# Altium schematic sheet 1x_limit_switch.SchDoc
size B; Author: AM; CompanyName: Expatria Technologies; DrawnBy: A.Marles; Engineer: AM; Organization: Expatria Technologies; DocumentNumber: 6; Revision: A1; SheetNumber: 6; SheetTotal: 14; PCB_Rev: A1
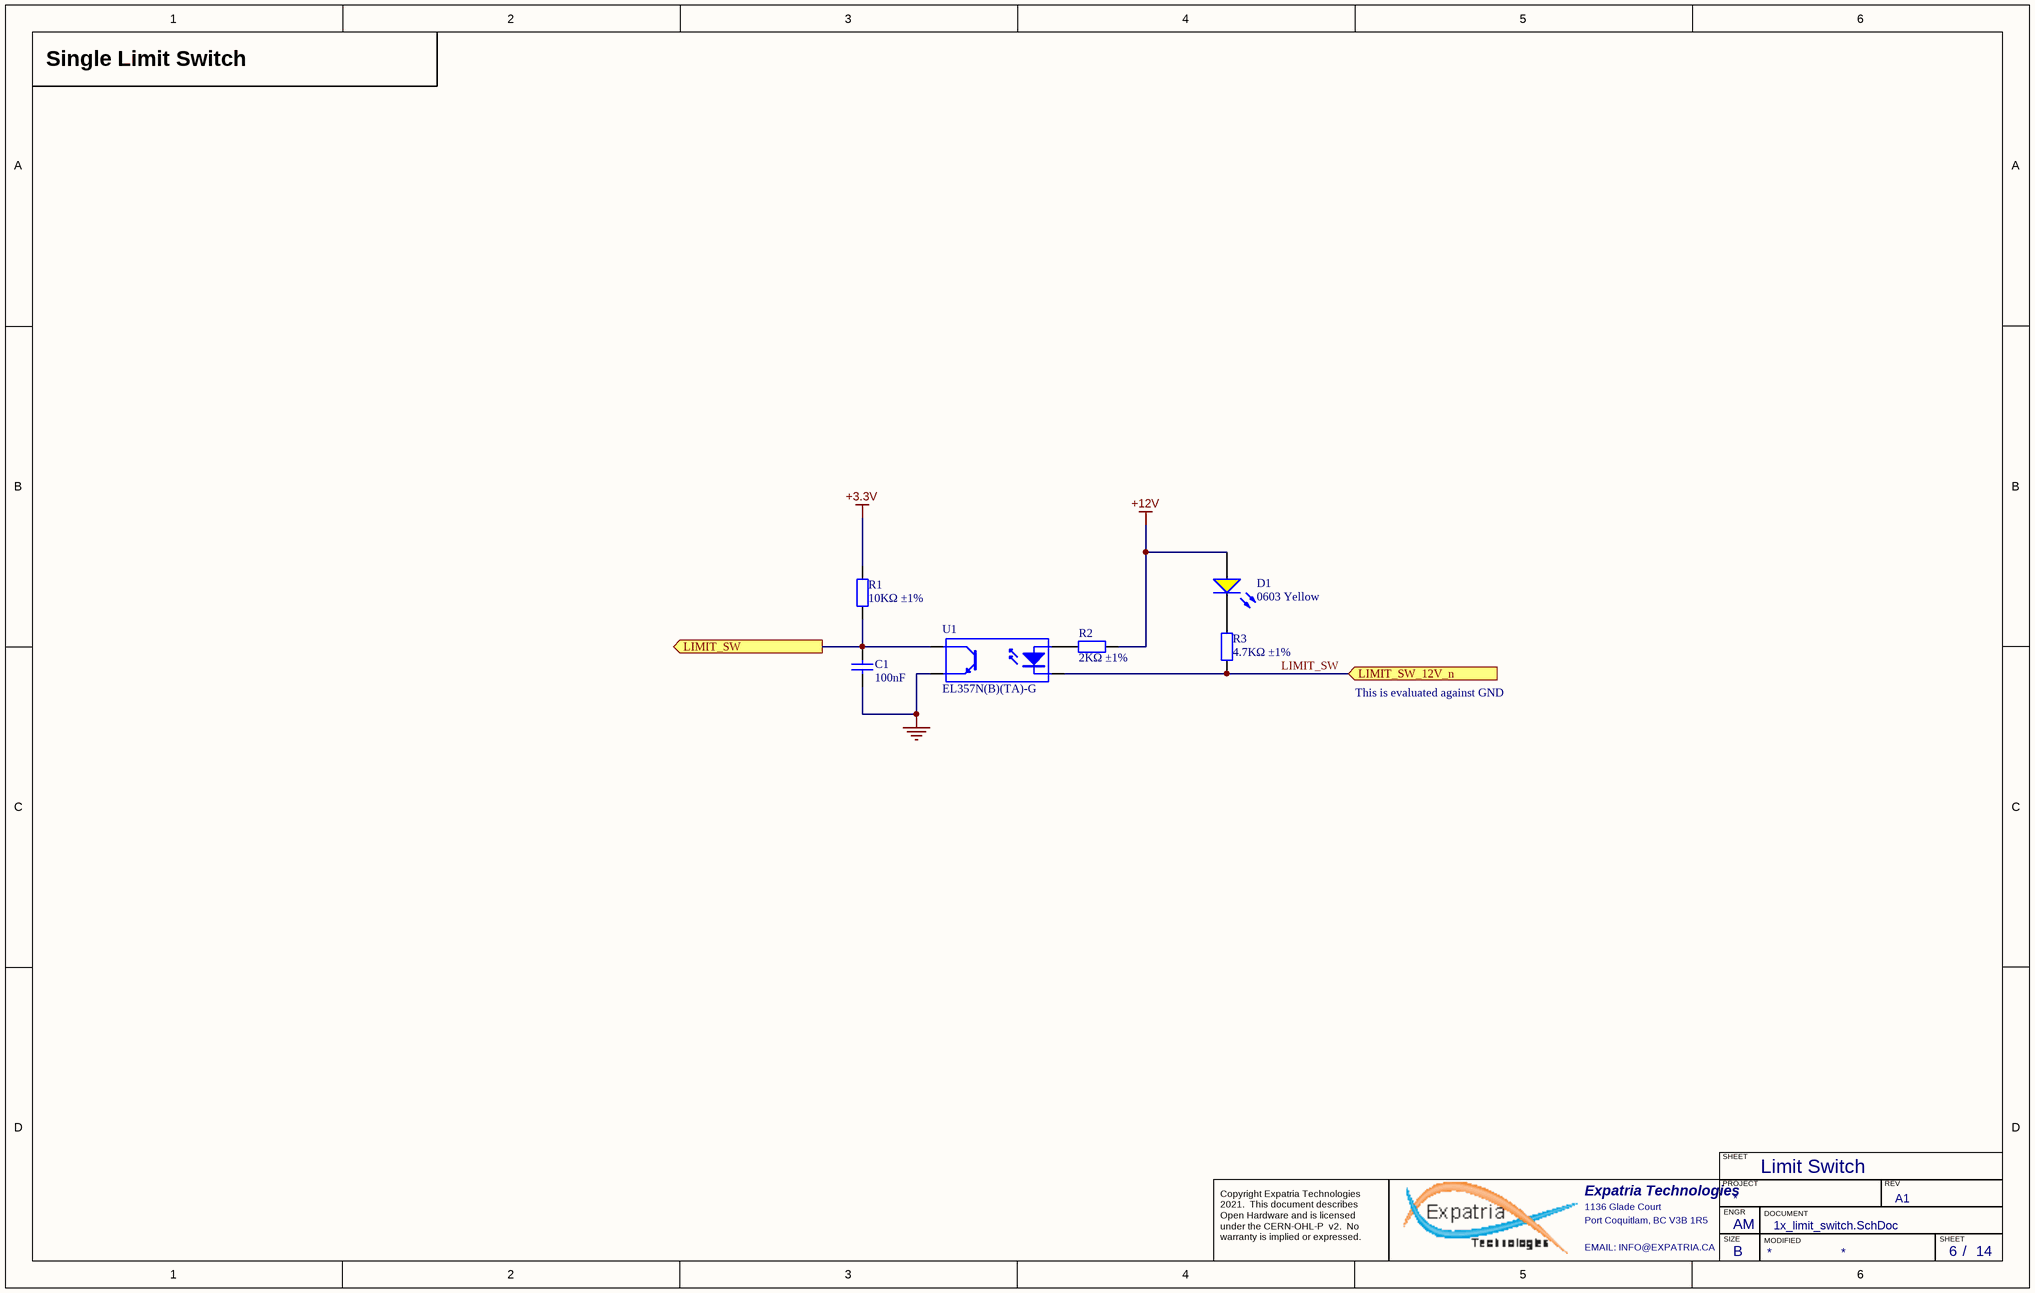
[diagram p0: 1x_limit_switch.SchDoc]

## Parts
C1  100nF  [0402_C]
D1  0603 Yellow  [0603_LED_S1]
R1  10KΩ ±1%  [0402_R]
R2  2KΩ ±1%  [0402_R]
R3  4.7KΩ ±1%  [0402_R]
U1  EL357N(B)(TA)-G  [SOP-4_P2.54]

## Ports
LIMIT_SW (out), LIMIT_SW_12V_n (in)

## Nets
+3.3V: R1.2
+12V: D1.A R2.2
GND: C1.1 U1.3(E)
LIMIT_SW: R3.1 U1.2(K) ; port LIMIT_SW_12V_n
LIMIT_SW: C1.2 R1.1 U1.4(C) ; port LIMIT_SW  [a separate net that carries the same name]
NetD1_K: D1.K R3.2
NetR2_1: R2.1 U1.1(A)

## Notes on the sheet
- Single Limit Switch
- This is evaluated against GND
- Limit Switch
- SHEET
- Expatria Technologies
- 1136 Glade Court
- Port Coquitlam, BC V3B 1R5
- PROJECT
- SIZE
- ENGR
- MODIFIED
- DOCUMENT
- REV
- Copyright Expatria Technologies 2021.  This document describes Open Hardware and is licensed under the CERN-OHL-P  v2.  No warranty is implied or expressed.
- EMAIL: INFO@EXPATRIA.CA
- B
- /

## Library data of the parts
C1 = 0402 100nF (104) 10% 16V: Chip capacitors; Manufacturer: Samsung Electro-Mechanics; PartNumber: CL05B104KO5NNNC; Tolerance: 10%; Voltage: 16V; Package: 0402; Supplier: LC; SuppliersPartNumber: C1525; Capacitance: 100nF
D1 = 0603 LED Yellow: LED; Package: 0603; Supplier: LC; SuppliersPartNumber: C72038; Color: Yellow
R1 = 0402 10K (1002) 1%: Chip resistor; Manufacturer: Uniroyal Elec; PartNumber: 0402WGF1002TCE; Power: 1/16W; Package: 0402; Supplier: LC; SuppliersPartNumber: C25744; Resistance: 10KΩ; Tolerance: 1%
R2 = 0402 2K (2001) 1%: Chip resistor; Manufacturer: Uniroyal Elec; PartNumber: 0402WGF2001TCE; Power: 1/16W; Package: 0402; Supplier: LC; SuppliersPartNumber: C4109; Resistance: 2KΩ; Tolerance: 1%
R3 = 0402 4.7K (4701) 1%: Chip resistor; Manufacturer: Uniroyal Elec; PartNumber: 0402WGF4701TCE; Power: 1/16W; Package: 0402; Supplier: LC; SuppliersPartNumber: C25900; Resistance: 4.7KΩ; Tolerance: 1%
U1 = EL357N(B)(TA)-G_[C6649]: 贴片光耦; Package: SOP-4_P2.54; Supplier: LC; SuppliersPartNumber: C6649